# EAGLE design pcb-inductive-sensor (EAGLE 9.6.2)
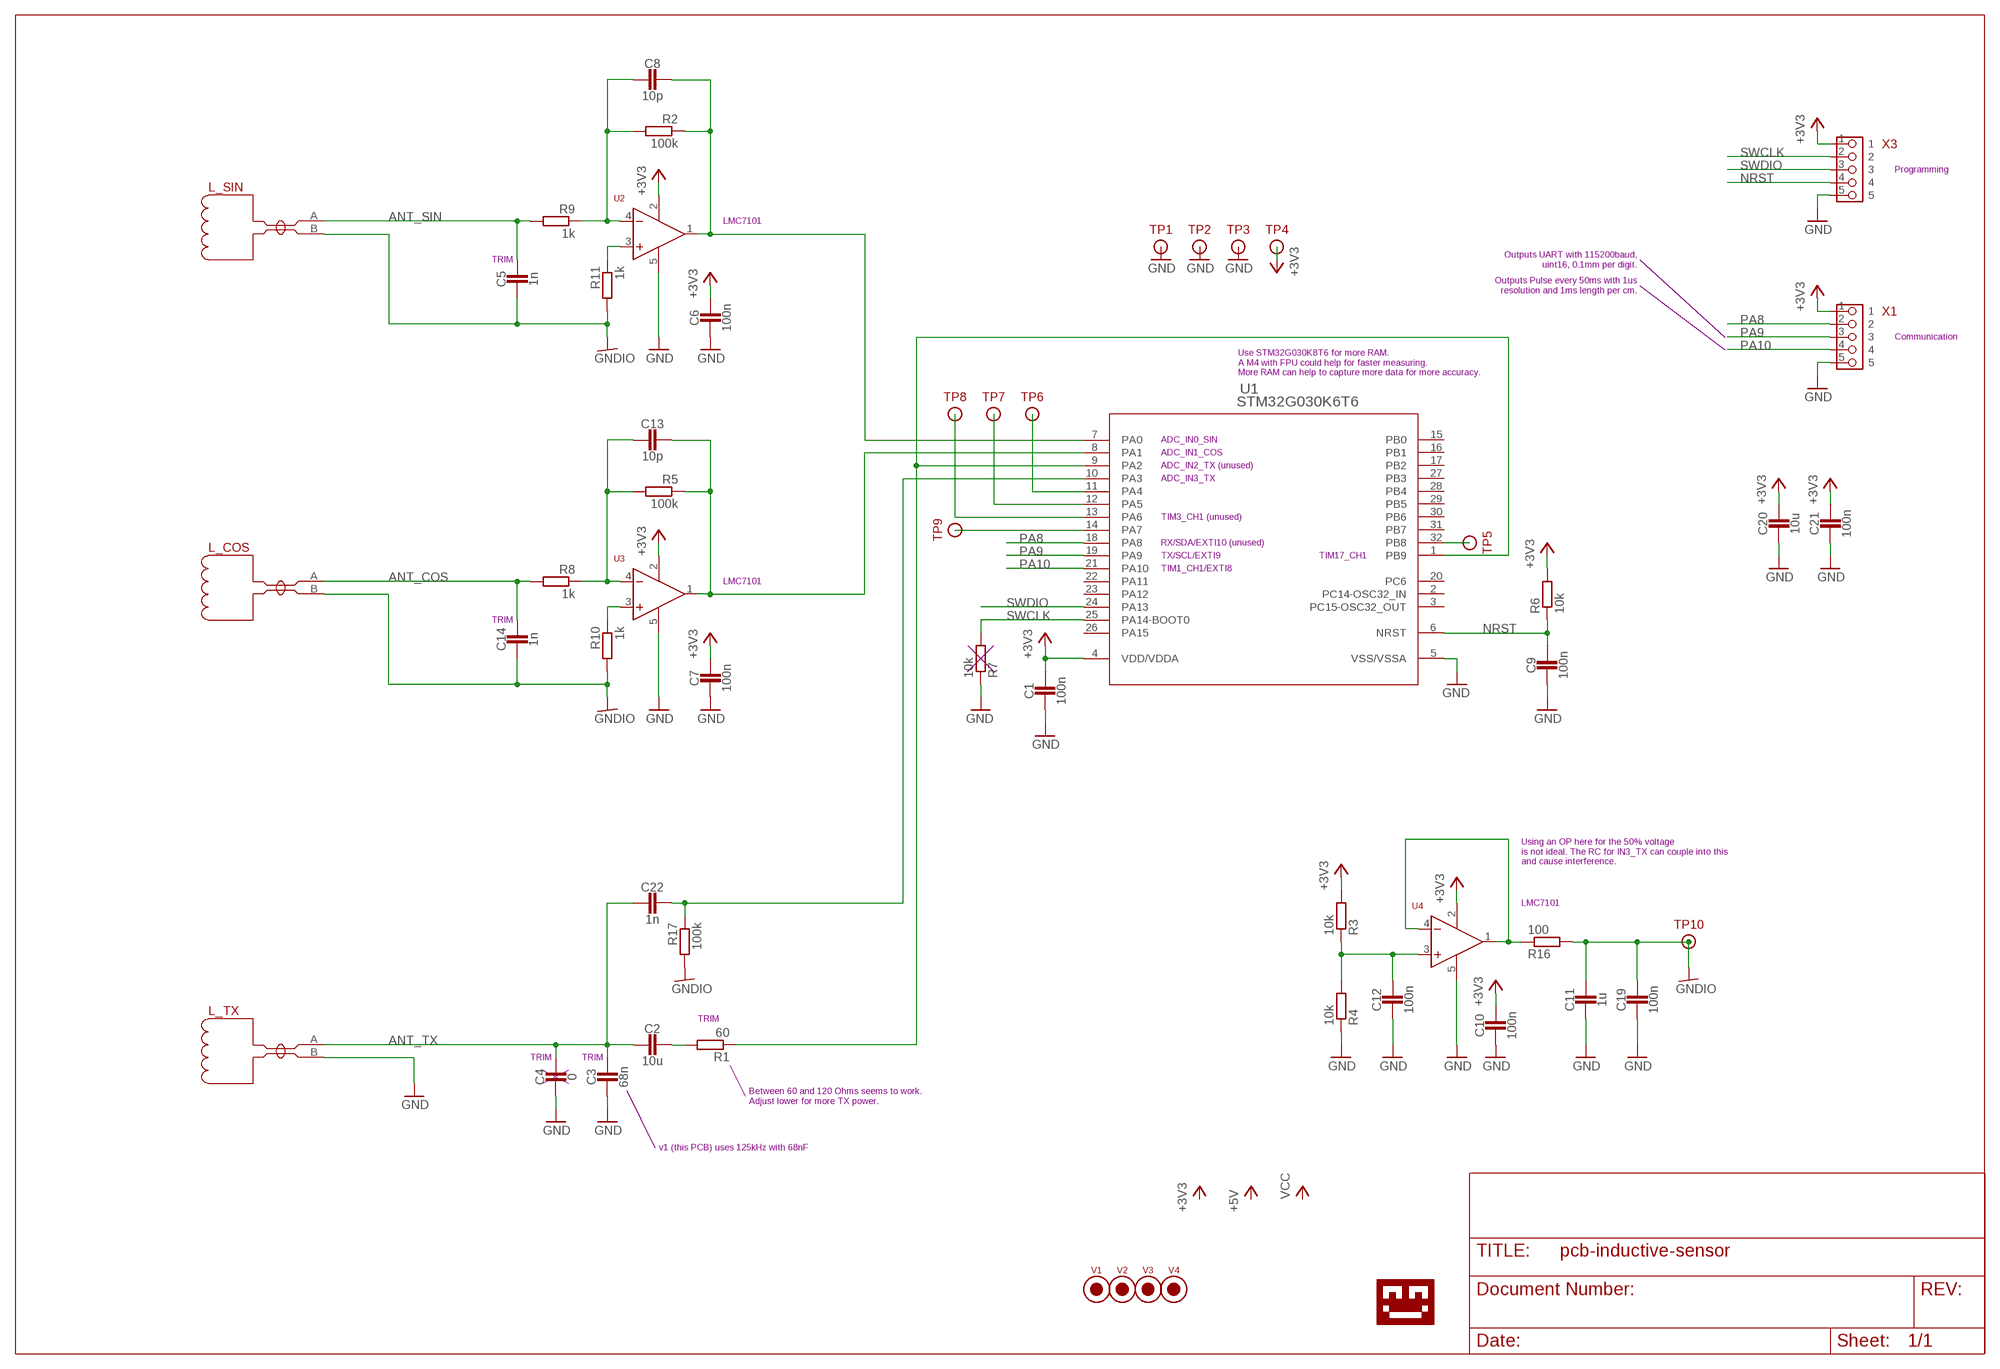
[diagram p0: schematic, sheet 1]

## Parts
C1  100n  CAPACITOR0603_CAP  [0603_CAP]
C2  10u  CAPACITOR0805_CAP  [0805_CAP]
C3  68n  CAPACITOR0603_CAP  [0603_CAP]
C4  0  CAPACITOR0603_CAP  [0603_CAP]
C5  1n  CAPACITOR0603_CAP  [0603_CAP]
C6  100n  CAPACITOR0603_CAP  [0603_CAP]
C7  100n  CAPACITOR0603_CAP  [0603_CAP]
C8  10p  CAPACITOR0603_CAP  [0603_CAP]
C9  100n  CAPACITOR0603_CAP  [0603_CAP]
C10  100n  CAPACITOR0603_CAP  [0603_CAP]
C11  1u  CAPACITOR0603_CAP  [0603_CAP]
C12  100n  CAPACITOR0603_CAP  [0603_CAP]
C13  10p  CAPACITOR0603_CAP  [0603_CAP]
C14  1n  CAPACITOR0603_CAP  [0603_CAP]
C19  100n  CAPACITOR0603_CAP  [0603_CAP]
C20  10u  CAPACITOR0805_CAP  [0805_CAP]
C21  100n  CAPACITOR0603_CAP  [0603_CAP]
C22  1n  CAPACITOR0603_CAP  [0603_CAP]
L_COS  INDUCTION_SENSOR  [INDUCTIVE_SENSOR_NET_TIE]
L_SIN  INDUCTION_SENSOR  [INDUCTIVE_SENSOR_NET_TIE]
L_TX  INDUCTION_SENSOR  [INDUCTIVE_SENSOR_NET_TIE]
R1  60  RESISTOR0805_RES  [0805_RES]
R2  100k  RESISTOR0603_RES  [0603-RES]
R3  10k  RESISTOR0603_RES  [0603-RES]
R4  10k  RESISTOR0603_RES  [0603-RES]
R5  100k  RESISTOR0603_RES  [0603-RES]
R6  10k  RESISTOR0603_RES  [0603-RES]
R7  10k  RESISTOR0603_RES  [0603-RES]
R8  1k  RESISTOR0603_RES  [0603-RES]
R9  1k  RESISTOR0603_RES  [0603-RES]
R10  1k  RESISTOR0603_RES  [0603-RES]
R11  1k  RESISTOR0603_RES  [0603-RES]
R16  100  RESISTOR0603_RES  [0603-RES]
R17  100k  RESISTOR0603_RES  [0603-RES]
TP1  TESTPIN  [PIN-SMD-1X1-TEST_1M5]
TP2  TESTPIN  [PIN-SMD-1X1-TEST_1M5]
TP3  TESTPIN  [PIN-SMD-1X1-TEST_1M5]
TP4  TESTPIN  [PIN-SMD-1X1-TEST_1M5]
TP5  TESTPIN  [PIN-SMD-1X1-TEST_1M5]
TP6  TESTPIN  [PIN-SMD-1X1-TEST_1M5]
TP7  TESTPIN  [PIN-SMD-1X1-TEST_1M5]
TP8  TESTPIN  [PIN-SMD-1X1-TEST_1M5]
TP9  TESTPIN  [PIN-SMD-1X1-TEST_1M5]
TP10  TESTPIN  [PIN-SMD-1X1-TEST_1M5]
U1  STM32G030K6T6  [LQFP-32]
U2  OPAMP-LMC7101  [SOT-23-5]
U3  OPAMP-LMC7101  [SOT-23-5]
U4  OPAMP-LMC7101  [SOT-23-5]
U$1  LOGO-TOBENG-1MM-FINISH  [TOBENG-1MM-FINISH]
V1  FIDUCIAL2MM  [FIDUCIAL_2MM]
V2  FIDUCIAL2MM  [FIDUCIAL_2MM]
V3  FIDUCIAL2MM  [FIDUCIAL_2MM]
V4  FIDUCIAL2MM  [FIDUCIAL_2MM]
X1  PIN_5X1HD  [PIN_5X1_HD]
X3  PIN_5X1HD  [PIN_5X1_HD]

## Nets
+3V3: C1.1 C6.1 C7.1 C10.1 C20.P$1 C21.1 R3.2 R6.2 TP4.1 U1.4(VDD/VDDA) U2.2(VCC) U3.2(VCC) U4.2(VCC) X1.1 X3.1
ANT_COS: C14.1 L_COS.A R8.2
ANT_SIN: C5.1 L_SIN.A R9.2
ANT_TX: C2.P$2 C3.1 C4.1 C22.2 L_TX.A
ANT_TX1: R1.1 U1.1(PB9) U1.9(PA2)
GND: C1.2 C3.2 C4.2 C6.2 C7.2 C9.2 C10.2 C11.2 C12.2 C19.2 C20.P$2 C21.2 L_TX.B R4.1 R7.1 TP1.1 TP2.1 TP3.1 U1.5(VSS/VSSA) U2.5(GND) U3.5(GND) U4.5(GND) X1.5 X3.5
GNDIO: C5.2 C11.1 C14.2 C19.1 L_COS.B L_SIN.B R10.2 R11.2 R16.2 R17.2 TP10.1
N$1: C8.1 R2.1 U1.7(PA0) U2.1(OUT)
N$2: C13.1 R5.1 U1.8(PA1) U3.1(OUT)
N$3: C22.1 R17.1 U1.10(PA3)
N$4: TP6.1 U1.11(PA4)
N$5: TP7.1 U1.12(PA5)
N$6: TP8.1 U1.13(PA6)
N$7: TP9.1 U1.14(PA7)
N$8: R16.1 U4.1(OUT) U4.4(-)
N$9: C8.2 R2.2 R9.1 U2.4(-)
N$10: TP5.1 U1.32(PB8)
N$11: C12.1 R3.1 R4.2 U4.3(+)
N$12: C13.2 R5.2 R8.1 U3.4(-)
N$14: R11.1 U2.3(+)
N$15: R10.1 U3.3(+)
N$16: C2.P$1 R1.2
NRST: C9.1 R6.1 U1.6(NRST) X3.4
PA8: U1.18(PA8) X1.2
PA9: U1.19(PA9) X1.3
PA10: U1.21(PA10) X1.4
SWCLK: R7.2 U1.25(PA14-BOOT0) X3.2
SWDIO: U1.24(PA13) X3.3
Unconnected: U1.2(PC14-OSC32_IN) U1.3(PC15-OSC32_OUT) U1.15(PB0) U1.16(PB1) U1.17(PB2) U1.20(PC6) U1.22(PA11) U1.23(PA12) U1.26(PA15) U1.27(PB3) U1.28(PB4) U1.29(PB5) U1.30(PB6) U1.31(PB7)

## Notes on the sheet
- Programming
- LMC7101
- TRIM
- Outputs UART with 115200baud,
  uint16, 0.1mm per digit.
- Outputs Pulse every 50ms with 1us
  resolution and 1ms length per cm.
- Communication
- Use STM32G030K8T6 for more RAM.
  A M4 with FPU could help for faster measuring.
  More RAM can help to capture more data for more accuracy.
- ADC_IN0_SIN
- ADC_IN1_COS
- ADC_IN2_TX (unused)
- ADC_IN3_TX
- TIM3_CH1 (unused)
- RX/SDA/EXTI10 (unused)
- TX/SCL/EXTI9 | TIM17_CH1
- TIM1_CH1/EXTI8
- LMC7101
- TRIM
- Using an OP here for the 50% voltage
  is not ideal. The RC for IN3_TX can couple into this
  and cause interference.
- LMC7101
- TRIM
- TRIM | TRIM
- Between 60 and 120 Ohms seems to work.
  Adjust lower for more TX power.
- v1 (this PCB) uses 125kHz with 68nF

## Library data of the parts
C1-C14 C19-C22 = passives:CAPACITOR: SMD Capacitor
L_COS L_SIN L_TX = ftobler:INDUCTION_SENSOR
R1-R11 R16 R17 = passives:RESISTOR: Resistor Basic schematic elements and footprints for 0201, 0402, 0603, 1206, and PTH resistors.
TP1-TP10 = ftobler:TESTPIN
U1 = stm32:STM32G030K6T6; BUILT_BY: EMA_UL_Team; COPYRIGHT: Copyright (C) 2018 Accelerated Designs. All rights reserved; MANUFACTURER_PART_NUMBER: STM32G030K6T6; SOURCELIBRARY: Updates_to_database_2020-10-19; VENDOR: STMicroelectronics
U2-U4 = ftobler:OPAMP
U$1 = ftobler:LOGO
V1-V4 = ftobler:FIDUCIAL
X1 X3 = ftobler-conn:PIN_5X1

## Board
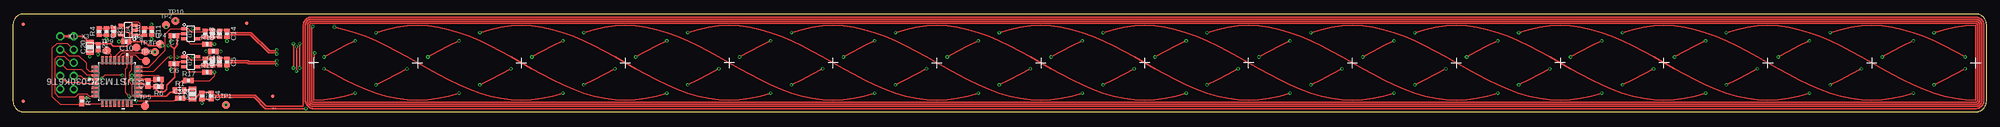
[diagram p1: board, top side]
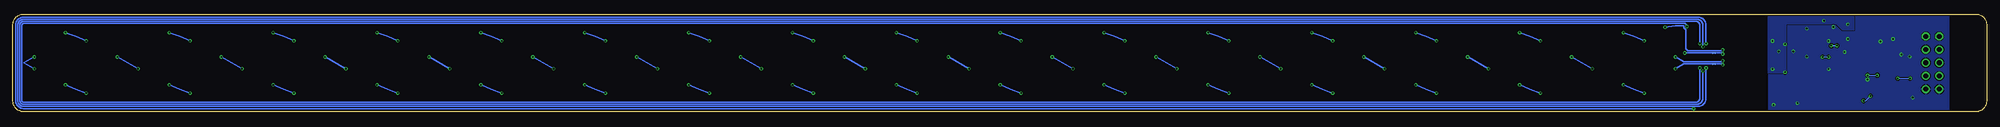
[diagram p2: board, bottom side, seen from below]

Size 380 x 18.8 mm. Coordinates in mm from the lower left corner, seen from the top.
Outline: 0,16.8 0,2 arc90 2,0 378,0 arc90 380,2 380,16.8 arc90 378,18.8 2,18.8 arc90 0,16.8
Copper layers (1*16): Top 0.035mm / dielectric 1.5mm / Bottom 0.035mm
Design rules "default *": minimum track width 0.15mm, minimum drill 0.3mm, track to track 0.15mm, track to pad 0.15mm, pad to pad 0.15mm, via to via 0.15mm, smd to smd 0.15mm, copper to edge 0.3mm, drill to drill 10mil, minimum pad ring 0.15mm, minimum via ring 0.15mm, stop-mask expansion 0.05mm, vias tented up to drill 0.35mm, thermal gap 0.2mm

### Footprints (pad centres in the part's own frame; a part is rotated, then mirrored left to right if it is on the bottom)
0603_CAP = smd 0.7 x 1: 1 -0.65,0; 2 0.65,0
0805_CAP = smd 0.8 x 1.4: P$1 1,0; P$2 -1,0
INDUCTIVE_SENSOR_NET_TIE = smd 0.2 x 0.2: A -0.2,0; B 0.2,0
0805_RES = smd 0.8 x 1.2: 1 -0.9,0; 2 0.9,0
0603-RES = smd 0.7 x 1: 1 -0.65,0; 2 0.65,0
PIN-SMD-1X1-TEST_1M5 = smd 1.5 x 1.5: 1 0,0
LQFP-32 = smd 1.473 x 0.508: 1 -4.115,2.8; 2 -4.115,2; 3 -4.115,1.2; 4 -4.115,0.4; 5 -4.115,-0.4; 6 -4.115,-1.2; 7 -4.115,-2; 8 -4.115,-2.8; 17 4.115,-2.8; 18 4.115,-2; 19 4.115,-1.2; 20 4.115,-0.4; 21 4.115,0.4; 22 4.115,1.2; 23 4.115,2; 24 4.115,2.8 | smd 0.508 x 1.473: 9 -2.8,-4.115; 10 -2,-4.115; 11 -1.2,-4.115; 12 -0.4,-4.115; 13 0.4,-4.115; 14 1.2,-4.115; 15 2,-4.115; 16 2.8,-4.115; 25 2.8,4.115; 26 2,4.115; 27 1.2,4.115; 28 0.4,4.115; 29 -0.4,4.115; 30 -1.2,4.115; 31 -2,4.115; 32 -2.8,4.115
SOT-23-5 = smd 1 x 0.55: 1 -1.35,0.95; 2 -1.35,0; 3 -1.35,-0.95; 4 1.35,-0.95; 5 1.35,0.95
FIDUCIAL_2MM = smd 0.7 x 0.7: V 0,0
PIN_5X1_HD = drill 0.9 pad 1.54 octagon: 1 0,0 | drill 0.9 pad 1.54: 2 0,-2.54; 3 0,-5.08; 4 0,-7.62; 5 0,-10.16

### Placement (x,y rotation side)
C1  26,5.4 90 top
C2  34.55,3.4 90 top
C3  36.4,3.05 270 top
C4  38.15,3.05 270 top
C5  41.2,9.6 270 top
C6  31,9.2 180 top
C7  31,14.6 180 top
C8  37,9.6 270 top
C9  28,6.2 180 top
C10  21.8,13.5 180 top
C11  26.7,15.4 270 top
C12  18,15.4 270 top
C13  37,15 270 top
C14  41.2,15 270 top
C19  38.6,11.6 180 top
C20  14.8,12.4 90 top
C21  16.4,12.4 270 top
C22  32.2,2.6 0 top
L_COS  52.5,11.3 0 bottom
L_SIN  52.5,9.2 0 bottom
L_TX  50.3,0.6 180 top
R1  32.1,4.14 0 top
R2  38.4,9.6 270 top
R3  19.4,15.4 270 top
R4  16.6,15.4 90 top
R5  38.4,15 270 top
R6  28,4.8 180 top
R7  13.25,2.05 270 top
R8  39.8,15 90 top
R9  39.8,9.6 90 top
R10  37.4,13 0 top
R11  37.4,7.6 0 top
R16  25.3,15.4 90 top
R17  33.8,6 0 top
TP1  41,1.3 0 top
TP2  29.5,16.7 0 top
TP3  27.3,11.5 0 top
TP4  28.3,13 0 top
TP5  25.4,1.1 0 top
TP6  25.6,9.8 0 top
TP7  25.5,11.6 0 top
TP8  23.8,12.4 0 top
TP9  18.1,11.8 0 top
TP10  31.3,17.5 0 top
U1  20,5.8 180 top
U2  34.2,9.6 0 top
U3  34.2,15 0 top
U4  22.2,15.7 180 top
U$1  47.6,9.4 0 top
V1  2,16.8 0 top
V2  45,17 0 top
V3  50,3 0 top
V4  2,2 0 top
X1  9.1,14.5 0 top
X3  11.7,14.5 0 top

### Tracks (layer width: path | path; a pad name or v marks a point on that pad's centre or on a via)
+3V3  (via drill 0.3 pad 0.6)
  Top 0.2: C1.1 26.05,4.8 | R3.2 19.45,14.75 20.1,15.4 22,15.4 22.45,14.95
  Top 0.3: 26.05,4.8 R6.2 27.35,4.55 28.1,3.8 29.1,3.8 29.6,4.3 29.6,5.1 31.1,6.6 31.1,8.65 C6.1 | U1.4 25.2,5.4 25.85,4.75 C1.1 | C10.1 22.45,14.95 23.2,15.7 U4.2 | C6.1 32.05,9.6 U2.2 | U3.2 32.05,15 C7.1 31.65,12.75 31,12.1 | C6.1 31,9.85 31,12.1 | C10.1 25.3,13.5 26.1,12.7 v28.8,12.7 28.43,12.7 TP4.1 | v29.9,12.7 30.4,12.7 31,12.1 | C10.1 22.45,13.25 21.8,12.6 19.3,12.6 18.85,13.05 C21.1 16.25,13.2 15,13.2 C20.P$1 14.6,13.4 13.5,14.5 X3.1
  Top 0.5: X1.1 X3.1
  Bottom 0.3: v28.8,12.7 v29.9,12.7
ANT_COS  (via drill 0.3 pad 0.6)
  Top 0.2: C14.1 R8.2
  Top 0.25: v119.9,10.53 121.9,11.62 123.9,12.67 v125.9,13.63 | v129.9,15.22 131.9,15.82 133.9,16.25 135.9,16.51 137.9,16.6 139.9,16.51 141.9,16.25 143.9,15.82 145.9,15.22 147.9,14.49 149.9,13.63 151.9,12.67 153.9,11.62 155.9,10.53 159.9,8.27 161.9,7.18 163.9,6.13 165.9,5.17 167.9,4.31 169.9,3.58 171.9,2.98 173.9,2.55 175.9,2.29 177.9,2.2 179.9,2.29 181.9,2.55 183.9,2.98 v185.9,3.58 | v115.9,8.27 113.9,7.18 111.9,6.13 v109.9,5.17 | v105.9,3.58 103.9,2.98 101.9,2.55 99.9,2.29 97.9,2.2 95.9,2.29 93.9,2.55 91.9,2.98 89.9,3.58 87.9,4.31 85.9,5.17 83.9,6.13 81.9,7.18 79.9,8.27 75.9,10.53 73.9,11.62 71.9,12.67 69.9,13.63 67.9,14.49 65.9,15.22 63.9,15.82 v61.9,16.25 | v199.9,10.53 201.9,11.62 203.9,12.67 v205.9,13.63 | v209.9,15.22 211.9,15.82 213.9,16.25 215.9,16.51 217.9,16.6 219.9,16.51 221.9,16.25 223.9,15.82 225.9,15.22 227.9,14.49 229.9,13.63 231.9,12.67 233.9,11.62 235.9,10.53 239.9,8.27 241.9,7.18 243.9,6.13 245.9,5.17 247.9,4.31 249.9,3.58 251.9,2.98 253.9,2.55 255.9,2.29 257.9,2.2 259.9,2.29 261.9,2.55 263.9,2.98 v265.9,3.58 | v195.9,8.27 193.9,7.18 191.9,6.13 v189.9,5.17 | v279.9,10.53 281.9,11.62 283.9,12.67 v285.9,13.63 | v289.9,15.22 291.9,15.82 293.9,16.25 295.9,16.51 297.9,16.6 299.9,16.51 301.9,16.25 303.9,15.82 305.9,15.22 307.9,14.49 309.9,13.63 311.9,12.67 313.9,11.62 315.9,10.53 319.9,8.27 321.9,7.18 323.9,6.13 325.9,5.17 327.9,4.31 329.9,3.58 331.9,2.98 333.9,2.55 335.9,2.29 337.9,2.2 339.9,2.29 341.9,2.55 343.9,2.98 v345.9,3.58 | v275.9,8.27 273.9,7.18 271.9,6.13 v269.9,5.17 | v359.9,10.53 361.9,11.62 363.9,12.67 v365.9,13.63
  Top 0.25: v369.9,15.22 371.9,15.82 373.9,16.25 375.9,16.51 377.9,16.6 377.9,2.2 375.9,2.29 373.9,2.55 371.9,2.98 369.9,3.58 367.9,4.31 365.9,5.17 363.9,6.13 361.9,7.18 359.9,8.27 355.9,10.53 353.9,11.62 351.9,12.67 349.9,13.63 347.9,14.49 345.9,15.22 343.9,15.82 341.9,16.25 339.9,16.51 337.9,16.6 335.9,16.51 333.9,16.25 331.9,15.82 v329.9,15.22 | v355.9,8.27 353.9,7.18 351.9,6.13 v349.9,5.17 | v155.9,8.27 153.9,7.18 151.9,6.13 v149.9,5.17 | v145.9,3.58 143.9,2.98 141.9,2.55 139.9,2.29 137.9,2.2 135.9,2.29 133.9,2.55 131.9,2.98 129.9,3.58 127.9,4.31 125.9,5.17 123.9,6.13 121.9,7.18 119.9,8.27 115.9,10.53 113.9,11.62 111.9,12.67 109.9,13.63 107.9,14.49 105.9,15.22 103.9,15.82 101.9,16.25 99.9,16.51 97.9,16.6 95.9,16.51 93.9,16.25 91.9,15.82 v89.9,15.22 | v79.9,10.53 81.9,11.62 83.9,12.67 v85.9,13.63 | v235.9,8.27 233.9,7.18 231.9,6.13 v229.9,5.17 | v225.9,3.58 223.9,2.98 221.9,2.55 219.9,2.29 217.9,2.2 215.9,2.29 213.9,2.55 211.9,2.98 209.9,3.58 207.9,4.31 205.9,5.17 203.9,6.13 201.9,7.18 199.9,8.27 195.9,10.53 193.9,11.62 191.9,12.67 189.9,13.63 187.9,14.49 185.9,15.22 183.9,15.82 181.9,16.25 179.9,16.51 177.9,16.6 175.9,16.51 173.9,16.25 171.9,15.82 v169.9,15.22 | v159.9,10.53 161.9,11.62 163.9,12.67 v165.9,13.63 | v315.9,8.27 313.9,7.18 311.9,6.13 v309.9,5.17 | v305.9,3.58 303.9,2.98 301.9,2.55 299.9,2.29 297.9,2.2 295.9,2.29 293.9,2.55 291.9,2.98 289.9,3.58 287.9,4.31 285.9,5.17 283.9,6.13 281.9,7.18 279.9,8.27 275.9,10.53 273.9,11.62 271.9,12.67 269.9,13.63 267.9,14.49 265.9,15.22 263.9,15.82 261.9,16.25 259.9,16.51 257.9,16.6 255.9,16.51 253.9,16.25 251.9,15.82 v249.9,15.22
  Top 0.25: v239.9,10.53 241.9,11.62 243.9,12.67 v245.9,13.63 | v319.9,10.53 321.9,11.62 323.9,12.67 v325.9,13.63 | v75.9,8.27 73.9,7.18 71.9,6.13 v69.9,5.17 | v65.9,3.58 63.9,2.98 61.9,2.55 59.9,2.29 57.9,2.2 57.9,10.1 v58.1,11.3 | C14.1 41.35,15.65 41.8,15.2 45.9,15.2 49.4,11.7 50.6,11.7 v50.8,11.9
  Bottom 0.25: v125.9,13.63 127.9,14.49 v129.9,15.22 | v119.9,10.53 v115.9,8.27 | v109.9,5.17 107.9,4.31 v105.9,3.58 | v205.9,13.63 207.9,14.49 v209.9,15.22 | v199.9,10.53 v195.9,8.27 | v189.9,5.17 187.9,4.31 v185.9,3.58 | v285.9,13.63 287.9,14.49 v289.9,15.22 | v279.9,10.53 v275.9,8.27 | v269.9,5.17 267.9,4.31 v265.9,3.58 | v365.9,13.63 367.9,14.49 v369.9,15.22 | v359.9,10.53 v355.9,8.27 | v349.9,5.17 347.9,4.31 v345.9,3.58 | v61.9,16.25 59.9,16.51 58.3,16.58 58.3,16.4 arc-53 58.06,15.92 57.9,15.8 57.9,12.1 57.5,11.7 51,11.7 v50.8,11.9 | v149.9,5.17 147.9,4.31 v145.9,3.58 | v85.9,13.63 87.9,14.49 v89.9,15.22 | v229.9,5.17 227.9,4.31 v225.9,3.58 | v155.9,8.27 v159.9,10.53 | v165.9,13.63 167.9,14.49 v169.9,15.22 | v309.9,5.17 307.9,4.31 v305.9,3.58 | v235.9,8.27 v239.9,10.53 | v245.9,13.63 247.9,14.49 v249.9,15.22 | v315.9,8.27 v319.9,10.53 | v325.9,13.63 327.9,14.49 v329.9,15.22 | v79.9,10.53 v75.9,8.27 | v69.9,5.17 67.9,4.31 v65.9,3.58 | v58.1,11.3 L_COS.A
ANT_SIN  (via drill 0.3 pad 0.6)
  Top 0.2: C5.1 R9.2
  Top 0.25: v135.9,8.27 133.9,7.18 131.9,6.13 v129.9,5.17 | v125.9,3.58 123.9,2.98 121.9,2.55 119.9,2.29 117.9,2.2 115.9,2.29 113.9,2.55 111.9,2.98 109.9,3.58 107.9,4.31 105.9,5.17 103.9,6.13 101.9,7.18 99.9,8.27 95.9,10.53 93.9,11.62 91.9,12.67 89.9,13.63 87.9,14.49 85.9,15.22 83.9,15.82 81.9,16.25 79.9,16.51 77.9,16.6 75.9,16.51 73.9,16.25 71.9,15.82 v69.9,15.22 | v59.9,10.53 61.9,11.62 63.9,12.67 v65.9,13.63 | v215.9,8.27 213.9,7.18 211.9,6.13 v209.9,5.17 | v205.9,3.58 203.9,2.98 201.9,2.55 199.9,2.29 197.9,2.2 195.9,2.29 193.9,2.55 191.9,2.98 189.9,3.58 187.9,4.31 185.9,5.17 183.9,6.13 181.9,7.18 179.9,8.27 175.9,10.53 173.9,11.62 171.9,12.67 169.9,13.63 167.9,14.49 165.9,15.22 163.9,15.82 161.9,16.25 159.9,16.51 157.9,16.6 155.9,16.51 153.9,16.25 151.9,15.82 v149.9,15.22 | v139.9,10.53 141.9,11.62 143.9,12.67 v145.9,13.63 | v295.9,8.27 293.9,7.18 291.9,6.13 v289.9,5.17 | v285.9,3.58 283.9,2.98 281.9,2.55 279.9,2.29 277.9,2.2 275.9,2.29 273.9,2.55 271.9,2.98 269.9,3.58 267.9,4.31 265.9,5.17 263.9,6.13 261.9,7.18 259.9,8.27 255.9,10.53 253.9,11.62 251.9,12.67 249.9,13.63 247.9,14.49 245.9,15.22 243.9,15.82 241.9,16.25 239.9,16.51 237.9,16.6 235.9,16.51 233.9,16.25 231.9,15.82 v229.9,15.22 | v219.9,10.53 221.9,11.62 223.9,12.67 v225.9,13.63 | v375.9,8.27 373.9,7.18 371.9,6.13 v369.9,5.17 | v365.9,3.58 363.9,2.98 361.9,2.55 359.9,2.29 357.9,2.2 355.9,2.29 353.9,2.55 351.9,2.98 349.9,3.58 347.9,4.31 345.9,5.17 343.9,6.13 341.9,7.18 339.9,8.27 335.9,10.53 333.9,11.62 331.9,12.67 329.9,13.63 327.9,14.49 325.9,15.22 323.9,15.82 321.9,16.25 319.9,16.51 317.9,16.6 315.9,16.51 313.9,16.25 311.9,15.82 v309.9,15.22
  Top 0.25: v299.9,10.53 301.9,11.62 303.9,12.67 v305.9,13.63 | v99.9,10.53 101.9,11.62 103.9,12.67 v105.9,13.63 | v109.9,15.22 111.9,15.82 113.9,16.25 115.9,16.51 117.9,16.6 119.9,16.51 121.9,16.25 123.9,15.82 125.9,15.22 127.9,14.49 129.9,13.63 131.9,12.67 133.9,11.62 135.9,10.53 139.9,8.27 141.9,7.18 143.9,6.13 145.9,5.17 147.9,4.31 149.9,3.58 151.9,2.98 153.9,2.55 155.9,2.29 157.9,2.2 159.9,2.29 161.9,2.55 163.9,2.98 v165.9,3.58 | v95.9,8.27 93.9,7.18 91.9,6.13 v89.9,5.17 | v85.9,3.58 83.9,2.98 81.9,2.55 79.9,2.29 77.9,2.2 75.9,2.29 73.9,2.55 71.9,2.98 69.9,3.58 67.9,4.31 65.9,5.17 63.9,6.13 61.9,7.18 v59.9,8.27 | v179.9,10.53 181.9,11.62 183.9,12.67 v185.9,13.63 | v189.9,15.22 191.9,15.82 193.9,16.25 195.9,16.51 197.9,16.6 199.9,16.51 201.9,16.25 203.9,15.82 205.9,15.22 207.9,14.49 209.9,13.63 211.9,12.67 213.9,11.62 215.9,10.53 219.9,8.27 221.9,7.18 223.9,6.13 225.9,5.17 227.9,4.31 229.9,3.58 231.9,2.98 233.9,2.55 235.9,2.29 237.9,2.2 239.9,2.29 241.9,2.55 243.9,2.98 v245.9,3.58 | v175.9,8.27 173.9,7.18 171.9,6.13 v169.9,5.17 | v259.9,10.53 261.9,11.62 263.9,12.67 v265.9,13.63 | v269.9,15.22 271.9,15.82 273.9,16.25 275.9,16.51 277.9,16.6 279.9,16.51 281.9,16.25 283.9,15.82 285.9,15.22 287.9,14.49 289.9,13.63 291.9,12.67 293.9,11.62 295.9,10.53 299.9,8.27 301.9,7.18 303.9,6.13 305.9,5.17 307.9,4.31 309.9,3.58 311.9,2.98 313.9,2.55 315.9,2.29 317.9,2.2 319.9,2.29 321.9,2.55 323.9,2.98 v325.9,3.58 | v255.9,8.27 253.9,7.18 251.9,6.13 v249.9,5.17 | v339.9,10.53 341.9,11.62 343.9,12.67 v345.9,13.63 | v349.9,15.22 351.9,15.82 353.9,16.25 355.9,16.51 357.9,16.6 359.9,16.51 361.9,16.25 363.9,15.82 365.9,15.22 367.9,14.49 369.9,13.63 371.9,12.67 373.9,11.62 v375.9,10.53
  Top 0.25: v335.9,8.27 333.9,7.18 331.9,6.13 v329.9,5.17 | v50.8,9.8 50.6,9.6 45.5,9.6 45.3,9.8 41.8,9.8 41.35,10.25 C5.1
  Bottom 0.25: v129.9,5.17 127.9,4.31 v125.9,3.58 | v59.9,10.53 58.25,9.6 51,9.6 v50.8,9.8 | v65.9,13.63 67.9,14.49 v69.9,15.22 | v209.9,5.17 207.9,4.31 v205.9,3.58 | v135.9,8.27 v139.9,10.53 | v145.9,13.63 147.9,14.49 v149.9,15.22 | v289.9,5.17 287.9,4.31 v285.9,3.58 | v215.9,8.27 v219.9,10.53 | v225.9,13.63 227.9,14.49 v229.9,15.22 | v375.9,8.27 377.9,9.4 v375.9,10.53 | v369.9,5.17 367.9,4.31 v365.9,3.58 | v295.9,8.27 v299.9,10.53 | v305.9,13.63 307.9,14.49 v309.9,15.22 | v105.9,13.63 107.9,14.49 v109.9,15.22 | v99.9,10.53 v95.9,8.27 | v89.9,5.17 87.9,4.31 v85.9,3.58 | v59.9,8.27 58.25,9.2 L_SIN.A | v185.9,13.63 187.9,14.49 v189.9,15.22 | v179.9,10.53 v175.9,8.27 | v169.9,5.17 167.9,4.31 v165.9,3.58 | v265.9,13.63 267.9,14.49 v269.9,15.22 | v259.9,10.53 v255.9,8.27 | v249.9,5.17 247.9,4.31 v245.9,3.58 | v345.9,13.63 347.9,14.49 v349.9,15.22 | v339.9,10.53 v335.9,8.27 | v329.9,5.17 327.9,4.31 v325.9,3.58
ANT_TX  (via drill 0.3 pad 0.6)
  Top 0.2: 34.35,2.2 C2.P$2 33.05,2.4 C22.2
  Top 0.25: v57.7,16.4 arc90 57.5,16.2 57.5,2.2 arc90 57.9,1.8 377.9,1.8 arc90 378.3,2.2 378.3,16.6 arc90 377.9,17 57.5,17 arc90 57.1,16.6 57.1,2.2 arc90 57.9,1.4 377.9,1.4 arc90 378.7,2.2 378.7,16.6 arc90 377.9,17.4 57.5,17.4 arc90 56.7,16.6 56.7,2.2 arc90 57.9,1 377.9,1 arc90 379.1,2.2 379.1,16.6 arc90 377.9,17.8 57.5,17.8 arc90 56.3,16.6 56.3,2.2 arc90 57.9,0.6 377.9,0.6 arc90 379.5,2.2 379.5,16.6 arc90 377.9,18.2 57.5,18.2 arc90 55.9,16.6 55.9,1 48.8,1 46.6,3.2 38.8,3.2 38.3,3.7 C4.1 C3.1 | v55.2,8.4 v55.2,13.1 | v54.6,7.8 v54.6,12.5 | v54,8.4 v54,13.1 | L_TX.A v56.4,0.6
  Top 0.3: C2.P$2 34.9,2.4 36.2,3.7 C3.1
  Bottom 0.25: v57.7,16.4 57.7,16.5 arc-90 58.2,17 377.9,17 arc-90 378.3,16.6 378.3,2.2 arc-90 377.9,1.8 56,1.8 arc-90 55.2,2.6 v55.2,8.4 | v55.2,13.1 55.2,16.6 arc-90 56,17.4 377.9,17.4 arc-90 378.7,16.6 378.7,2.2 arc-90 377.9,1.4 55.8,1.4 arc-90 54.6,2.6 v54.6,7.8 | v54.6,12.5 54.6,16.6 arc-90 55.8,17.8 377.9,17.8 arc-90 379.1,16.6 379.1,2.2 arc-90 377.9,1 55.6,1 arc-90 54,2.6 v54,8.4 | v54,13.1 54,16.6 arc-90 55.6,18.2 377.9,18.2 arc-90 379.5,16.6 379.5,2.2 arc-90 377.9,0.6 v56.4,0.6
ANT_TX1
  Top 0.2: U1.9 22.8,7.98 22.35,7.53 22.35,5.77 22.9,5.22 22.9,3.3 23.2,3 U1.1 | R1.1 31.27,4.2
  Top 0.3: U1.1 29.5,3 30.23,3.73 30.9,3.73 31.2,4.04 R1.1
GND  (via drill 0.3 pad 0.6)
  Top 0.2: C1.2 27.2,6.05 C9.2 | R7.1 v14.2,2.7
  Top 0.25: L_TX.B 48.6,0.6 46.4,2.8 38.8,2.8 38.4,2.4 C4.2 C3.2
  Top 0.3: R4.1 C12.2 v18,14 | C1.2 25.85,6.2 U1.5 v22.9,6.2 | C3.2 v36.4,1.65 | C10.2 21.1,13.55 21.1,14.8 20.9,14.8 U4.5 | C11.2 v26.7,14 | C7.2 30.4,14.55 v30.4,13.6 | C6.2 30.4,9.15 v30.4,8.2 | U3.5 34.65,15.95 v34.6,16 | U2.5 34.65,10.55 v34.6,10.6 | C19.2 v37.2,11.6 | C20.P$2 v14.8,10.6 | C21.2 v16.4,11 | TP2.1 v29.5,16.3
  Top 0.4: C10.2 v20.4,13.5
  other vias: 27.3,11.5 41,1.3
  pour Bottom (rank 3): 7.2,20.4 42,20.4 42,-1.6 7.2,-1.6
GNDIO  (via drill 0.3 pad 0.6)
  Top 0.2: R17.2 37.9,6 38.8,6.9 v38.8,7.6
  Top 0.25: 41.25,14.4 C14.2 41.35,14.35 41.8,14.8 45.7,14.8 49.2,11.3 50.6,11.3 v50.8,11.1 | v50.8,9 50.6,9.2 45.33,9.2 45.13,9.4 41.8,9.4 41.35,8.95 C5.2
  Top 0.3: C14.2 v41.2,13.6 | C5.2 v41.2,8.2 | v38.8,7.6 R11.2 | v38.8,13 R10.2 | R16.2 C11.1 v26.7,16.8 | C19.1 v40,11.6
  Bottom 0.25: v50.8,9 51,9.2 L_SIN.B | v50.8,11.1 51,11.3 L_COS.B
  other vias: 31.3,17.5
  pour Bottom (isolate 0.2, rank 2): 25.6,20.2 25.6,15.7 27.7,15.7 28.8,16.8 38.6,16.8 38.6,7.4 42,7.4 42,20.2
N$1  (via drill 0.3 pad 0.6)
  Top 0.2: v31.6,10.5 32.8,10.5 U2.1 33.75,10.55 34.38,9.93 36.38,9.93 36.7,10.25 C8.1 R2.1 | U1.7 27.1,7.8 29.8,10.5 v30.4,10.5
  Bottom 0.2: v30.4,10.5 v31.6,10.5
N$2
  Top 0.2: R5.1 C13.1 36.7,15.65 36.38,15.32 34.38,15.32 33.75,15.95 U3.1 30.35,15.95 29.35,14.95 29.35,11.85 26.1,8.6 U1.8
N$3  (via drill 0.3 pad 0.6)
  Top 0.2: U1.10 22,8.6 21.6,8.2 21.6,3.75 v22.35,3 | R17.1 32.5,6 32,5.5 32,3.3 31.55,2.85 C22.1 31.05,2.1 v23.7,2.1
  Bottom 0.2: v23.7,2.1 23.25,2.1 v22.35,3
N$4
  Top 0.2: U1.11 21.35,10.06 21.35,10.75 21.6,11 23.5,11 24.4,10.1 25.69,10.1 TP6.1
N$5
  Top 0.2: U1.12 20.55,10.06 20.55,10.75 21.15,11.35 25.56,11.35 TP7.1
N$6
  Top 0.2: U1.13 19.75,10.06 19.75,10.75 20.7,11.7 23.1,11.7 TP8.1
N$7
  Top 0.2: TP9.1 18.8,11.1 U1.14
N$8
  Top 0.2: U4.4 21.05,16.65 21.68,17.27 24.15,17.27 24.4,17.03 24.4,14.75
  Top 0.3: U4.1 24.4,14.75 R16.1
N$9
  Top 0.2: R9.1 R2.2 C8.2 36.05,8.95 35.75,8.65 U2.4
N$10
  Top 0.2: U1.32 22.9,1.58 22.9,1.4 25.52,1.4 TP5.1
N$11
  Top 0.2: R4.2 C12.1 R3.1 22.05,16.05 22.65,16.65 U4.3
N$12
  Top 0.2: R8.1 R5.2 C13.2 36.05,14.35 35.75,14.05 U3.4
N$14
  Top 0.2: R11.1 34.2,7.6 33.15,8.65 U2.3
N$15
  Top 0.2: R10.1 34.2,13 33.15,14.05 U3.3
N$16
  Top 0.3: C2.P$1 34.38,4.24 33.1,4.24 R1.2
NRST  (via drill 0.3 pad 0.6)
  Top 0.2: R6.1 28.6,4.85 28.65,4.9 C9.1 28.65,6.35 28,7 U1.6 v22.9,7 | v21.05,7 17.7,7 v17.1,6.4 | X3.4 13.02,6.88 13.5,6.4 v14.7,6.4
  Bottom 0.2: v22.9,7 v21.05,7 | v17.1,6.4 v14.7,6.4
PA8
  Top 0.2: U1.18 14.7,7.8 14.1,8.4 14.1,9.4 12.8,10.7 10.86,10.7 9.6,11.96 X1.2
PA9
  Top 0.2: U1.19 14.3,7 13.2,8.1 10.42,8.1 X1.3
PA10
  Top 0.2: X1.4 10.38,5.6 13.1,5.6 13.3,5.4 U1.21
SWCLK
  Top 0.2: U1.25 16.91,1.4 R7.2 9.1,1.4 7.6,2.9 7.6,12.3 8.5,13.2 10.46,13.2 X3.2
SWDIO
  Top 0.2: U1.24 14.7,3 14.2,3.5 12.7,3.5 12.1,2.9 8.7,2.9 8,3.6 8,10.1 8.6,10.7 9.9,10.7 11.18,9.42 X3.3

### Text on the board
tFinish: ref | V1 | V2 | pcb-inductive-sensor v1 / 2023 by ftobler | cos | 3V3 | + | C | PA8 | sin | PA9 | D | PA10 | R | GND | G | tx | V3 | V4 | JLCJLCJLCJLCJLCJLC